# Altium schematic sheet 10_EEPROM.SchDoc: Power and Incoming USB
size A2; Organization: Greenfield Tech Solutions; Address1: Molendreef 33; Address2: Ossendrecht; Address3: 4641CS; Address4: The Netherlands; SheetNumber: 10; SheetTotal: 10
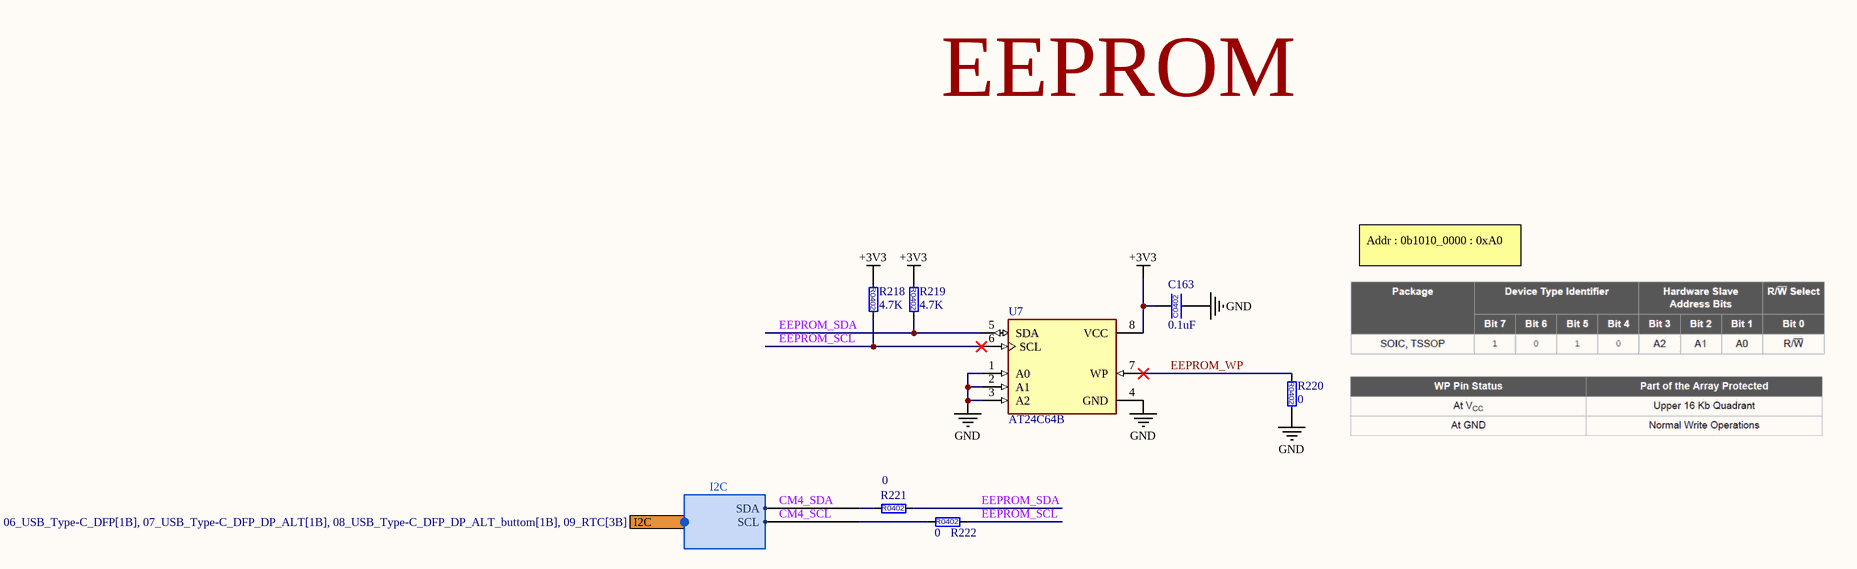
[diagram p0: 10_EEPROM.SchDoc]

## Parts
C163  0.1uF  [C0402]
R218  4.7K  [R0402]
R219  4.7K  [R0402]
R220  0  [R0402]
R221  0  [R0402]
R222  0  [R0402]
U7  AT24C64B  [AT24C64B_SOIC_8]

## Ports
I2C (harness I2C, see 01_Top[3B], 03_RPiCM4[1A], 05_HDMI_to_DP[1B], 06_USB_Type-C_DFP[1B], 07_USB_Type-C_DFP_DP_ALT[1B], 08_USB_Type-C_DFP_DP_ALT_buttom[1B], 09_RTC[3B])

## Harnesses
I2C: SDA, SCL

## Nets
+3V3: C163.1 R218.1 R219.1 U7.8(VCC)
GND: C163.2 R220.2 U7.1(A0) U7.2(A1) U7.3(A2) U7.4(GND)
CM4_SCL: R222.1 ; port I2C.SCL
CM4_SDA: R221.1 ; port I2C.SDA
EEPROM_SCL: R218.2 R222.2 U7.6(SCL)
EEPROM_SDA: R219.2 R221.2 U7.5(SDA)
EEPROM_WP: R220.1 U7.7(WP)

## Notes on the sheet
- EEPROM
- Addr : 0b1010_0000 : 0xA0
- Title
- Size:
- Date:
- File:
- A2
- Number:
- Time:
- Revision:
- Sheet
- of
- (in symbol 04023D104KAT2A) C0402
- (in symbol CRCW04024K7FK) R0402
- (in symbol CRCW04020000Z0) R0402

## Library data of the parts
C163 = 04023D104KAT2A: CAP CER  0.1uF 10% 25V X5R 0402; Manufacturer: AVX Corporation; Manufacturer Part Number: 04023D104KAT2A; Value: 0.1uF; Voltage - Rated: 25V; Tolerance: ±10%; Temperature Coefficient: X5R
R218 R219 = CRCW04024K7FK: RES SMD 4.7K ohm 1% 1/16W R0402; Manufacturer: Vishay Dale; Manufacturer Part Number: CRCW04024K7FK; Value: 4.7K; Power (Watts): 1/16W; Package / Case: 0805 (2012 Metric); Tolerance: ±1%
R220-R222 = CRCW04020000Z0: RES SMD 0 ohm 1/16W R0402; Manufacturer: Vishay Dale; Manufacturer Part Number: CRCW04020000Z0; Value: 0; Power (Watts): 1/16W; Package / Case: 0402
U7 = AT24C64B: IC EEPROM 64K I2C 400KHZ 8SOIC; Manufacturer: Microchip; Manufacturer Part Number: AT24C64BN-10SU-2.7; Supplier 1: Digi-Key; RoHS: Yes; Category: EEPROM; Stock 1: 32; Pricing 1: 1=0.76000 (USD); Supplier Part Number 1: AT24C64BN-10SU-2.7-ND